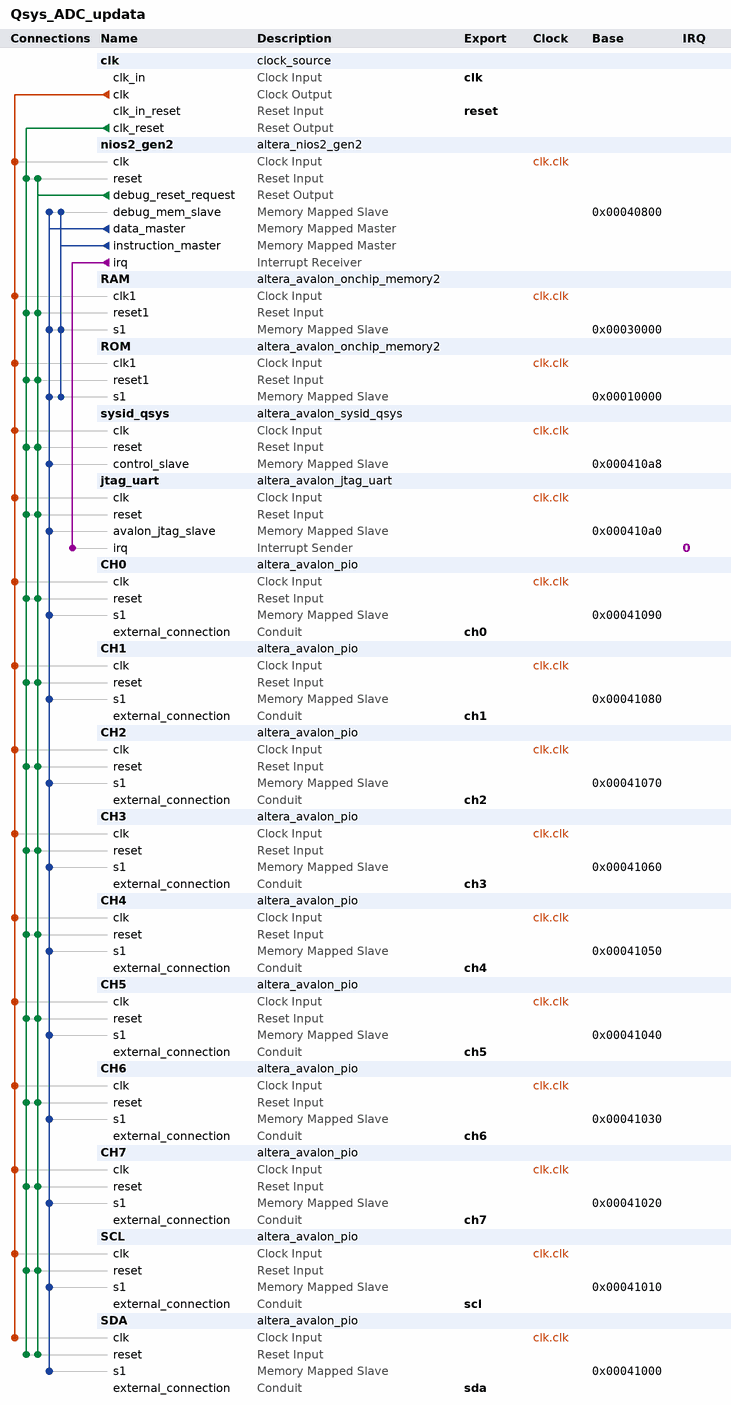
[diagram p0: system contents]
# Platform Designer (Qsys) system Qsys_ADC_updata, Cyclone V 5CSEMA5F31C6
# Parameters at their usual value, and those the tool derives, are not listed.
package require -exact qsys 17.1
create_system Qsys_ADC_updata
set_project_property DEVICE_FAMILY {Cyclone V}
set_project_property DEVICE 5CSEMA5F31C6

add_instance clk clock_source 17.1
set_instance_parameter_value clk clockFrequency 100000000

add_instance nios2_gen2 altera_nios2_gen2 17.1
set_instance_parameter_value nios2_gen2 dcache_size 2048
set_instance_parameter_value nios2_gen2 exceptionSlave RAM.s1
set_instance_parameter_value nios2_gen2 icache_size 4096
set_instance_parameter_value nios2_gen2 impl Fast
set_instance_parameter_value nios2_gen2 resetSlave ROM.s1

add_instance RAM altera_avalon_onchip_memory2 17.1
set_instance_parameter_value RAM dataWidth 32
set_instance_parameter_value RAM dualPort false
set_instance_parameter_value RAM initMemContent true
set_instance_parameter_value RAM initializationFileName E:/DE1-SoC/FPGA_Qsys/Qsys_ADC_update/software/Qsys_ADC_updata/mem_init/Qsys_ADC_updata_RAM.hex
set_instance_parameter_value RAM memorySize 40960
set_instance_parameter_value RAM useNonDefaultInitFile true

add_instance ROM altera_avalon_onchip_memory2 17.1
set_instance_parameter_value ROM dataWidth 32
set_instance_parameter_value ROM dualPort false
set_instance_parameter_value ROM initMemContent true
set_instance_parameter_value ROM initializationFileName E:/DE1-SoC/FPGA_Qsys/Qsys_ADC_update/software/Qsys_ADC_updata/mem_init/Qsys_ADC_updata_ROM.hex
set_instance_parameter_value ROM memorySize 65536
set_instance_parameter_value ROM useNonDefaultInitFile true
set_instance_parameter_value ROM writable false

add_instance sysid_qsys altera_avalon_sysid_qsys 17.1
set_instance_parameter_value sysid_qsys id 0

add_instance jtag_uart altera_avalon_jtag_uart 17.1
set_instance_parameter_value jtag_uart simInteractiveOptions NO_INTERACTIVE_WINDOWS

add_instance CH0 altera_avalon_pio 17.1
set_instance_parameter_value CH0 direction Input
set_instance_parameter_value CH0 width 12

add_instance CH1 altera_avalon_pio 17.1
set_instance_parameter_value CH1 direction Input
set_instance_parameter_value CH1 width 12

add_instance CH2 altera_avalon_pio 17.1
set_instance_parameter_value CH2 direction Input
set_instance_parameter_value CH2 width 12

add_instance CH3 altera_avalon_pio 17.1
set_instance_parameter_value CH3 direction Input
set_instance_parameter_value CH3 width 12

add_instance CH4 altera_avalon_pio 17.1
set_instance_parameter_value CH4 direction Input
set_instance_parameter_value CH4 width 12

add_instance CH5 altera_avalon_pio 17.1
set_instance_parameter_value CH5 direction Input
set_instance_parameter_value CH5 width 12

add_instance CH6 altera_avalon_pio 17.1
set_instance_parameter_value CH6 direction Input
set_instance_parameter_value CH6 width 12

add_instance CH7 altera_avalon_pio 17.1
set_instance_parameter_value CH7 direction Input
set_instance_parameter_value CH7 width 12

add_instance SCL altera_avalon_pio 17.1
set_instance_parameter_value SCL direction Output
set_instance_parameter_value SCL width 1

add_instance SDA altera_avalon_pio 17.1
set_instance_parameter_value SDA direction Bidir
set_instance_parameter_value SDA width 1

# connections
add_connection clk.clk CH0.clk clock
add_connection clk.clk CH1.clk clock
add_connection clk.clk CH2.clk clock
add_connection clk.clk CH3.clk clock
add_connection clk.clk CH4.clk clock
add_connection clk.clk CH5.clk clock
add_connection clk.clk CH6.clk clock
add_connection clk.clk CH7.clk clock
add_connection clk.clk jtag_uart.clk clock
add_connection clk.clk nios2_gen2.clk clock
add_connection clk.clk RAM.clk1 clock
add_connection clk.clk ROM.clk1 clock
add_connection clk.clk SCL.clk clock
add_connection clk.clk SDA.clk clock
add_connection clk.clk sysid_qsys.clk clock
add_connection clk.clk_reset CH0.reset reset
add_connection clk.clk_reset CH1.reset reset
add_connection clk.clk_reset CH2.reset reset
add_connection clk.clk_reset CH3.reset reset
add_connection clk.clk_reset CH4.reset reset
add_connection clk.clk_reset CH5.reset reset
add_connection clk.clk_reset CH6.reset reset
add_connection clk.clk_reset CH7.reset reset
add_connection clk.clk_reset jtag_uart.reset reset
add_connection clk.clk_reset nios2_gen2.reset reset
add_connection clk.clk_reset RAM.reset1 reset
add_connection clk.clk_reset ROM.reset1 reset
add_connection clk.clk_reset SCL.reset reset
add_connection clk.clk_reset SDA.reset reset
add_connection clk.clk_reset sysid_qsys.reset reset
add_connection nios2_gen2.debug_reset_request CH0.reset reset
add_connection nios2_gen2.debug_reset_request CH1.reset reset
add_connection nios2_gen2.debug_reset_request CH2.reset reset
add_connection nios2_gen2.debug_reset_request CH3.reset reset
add_connection nios2_gen2.debug_reset_request CH4.reset reset
add_connection nios2_gen2.debug_reset_request CH5.reset reset
add_connection nios2_gen2.debug_reset_request CH6.reset reset
add_connection nios2_gen2.debug_reset_request CH7.reset reset
add_connection nios2_gen2.debug_reset_request jtag_uart.reset reset
add_connection nios2_gen2.debug_reset_request nios2_gen2.reset reset
add_connection nios2_gen2.debug_reset_request RAM.reset1 reset
add_connection nios2_gen2.debug_reset_request ROM.reset1 reset
add_connection nios2_gen2.debug_reset_request SCL.reset reset
add_connection nios2_gen2.debug_reset_request SDA.reset reset
add_connection nios2_gen2.debug_reset_request sysid_qsys.reset reset
add_connection nios2_gen2.data_master CH0.s1 avalon
set_connection_parameter_value nios2_gen2.data_master/CH0.s1 baseAddress 0x00041090
add_connection nios2_gen2.data_master CH1.s1 avalon
set_connection_parameter_value nios2_gen2.data_master/CH1.s1 baseAddress 0x00041080
add_connection nios2_gen2.data_master CH2.s1 avalon
set_connection_parameter_value nios2_gen2.data_master/CH2.s1 baseAddress 0x00041070
add_connection nios2_gen2.data_master CH3.s1 avalon
set_connection_parameter_value nios2_gen2.data_master/CH3.s1 baseAddress 0x00041060
add_connection nios2_gen2.data_master CH4.s1 avalon
set_connection_parameter_value nios2_gen2.data_master/CH4.s1 baseAddress 0x00041050
add_connection nios2_gen2.data_master CH5.s1 avalon
set_connection_parameter_value nios2_gen2.data_master/CH5.s1 baseAddress 0x00041040
add_connection nios2_gen2.data_master CH6.s1 avalon
set_connection_parameter_value nios2_gen2.data_master/CH6.s1 baseAddress 0x00041030
add_connection nios2_gen2.data_master CH7.s1 avalon
set_connection_parameter_value nios2_gen2.data_master/CH7.s1 baseAddress 0x00041020
add_connection nios2_gen2.data_master jtag_uart.avalon_jtag_slave avalon
set_connection_parameter_value nios2_gen2.data_master/jtag_uart.avalon_jtag_slave baseAddress 0x000410a0
add_connection nios2_gen2.data_master nios2_gen2.debug_mem_slave avalon
set_connection_parameter_value nios2_gen2.data_master/nios2_gen2.debug_mem_slave baseAddress 0x00040800
add_connection nios2_gen2.data_master RAM.s1 avalon
set_connection_parameter_value nios2_gen2.data_master/RAM.s1 baseAddress 0x00030000
add_connection nios2_gen2.data_master ROM.s1 avalon
set_connection_parameter_value nios2_gen2.data_master/ROM.s1 baseAddress 0x00010000
add_connection nios2_gen2.data_master SCL.s1 avalon
set_connection_parameter_value nios2_gen2.data_master/SCL.s1 baseAddress 0x00041010
add_connection nios2_gen2.data_master SDA.s1 avalon
set_connection_parameter_value nios2_gen2.data_master/SDA.s1 baseAddress 0x00041000
add_connection nios2_gen2.data_master sysid_qsys.control_slave avalon
set_connection_parameter_value nios2_gen2.data_master/sysid_qsys.control_slave baseAddress 0x000410a8
add_connection nios2_gen2.instruction_master nios2_gen2.debug_mem_slave avalon
set_connection_parameter_value nios2_gen2.instruction_master/nios2_gen2.debug_mem_slave baseAddress 0x00040800
add_connection nios2_gen2.instruction_master RAM.s1 avalon
set_connection_parameter_value nios2_gen2.instruction_master/RAM.s1 baseAddress 0x00030000
add_connection nios2_gen2.instruction_master ROM.s1 avalon
set_connection_parameter_value nios2_gen2.instruction_master/ROM.s1 baseAddress 0x00010000
add_connection nios2_gen2.irq jtag_uart.irq interrupt
set_connection_parameter_value nios2_gen2.irq/jtag_uart.irq irqNumber 0

# exported interfaces
add_interface ch0 conduit end
set_interface_property ch0 EXPORT_OF CH0.external_connection
add_interface ch1 conduit end
set_interface_property ch1 EXPORT_OF CH1.external_connection
add_interface ch2 conduit end
set_interface_property ch2 EXPORT_OF CH2.external_connection
add_interface ch3 conduit end
set_interface_property ch3 EXPORT_OF CH3.external_connection
add_interface ch4 conduit end
set_interface_property ch4 EXPORT_OF CH4.external_connection
add_interface ch5 conduit end
set_interface_property ch5 EXPORT_OF CH5.external_connection
add_interface ch6 conduit end
set_interface_property ch6 EXPORT_OF CH6.external_connection
add_interface ch7 conduit end
set_interface_property ch7 EXPORT_OF CH7.external_connection
add_interface clk clock sink
set_interface_property clk EXPORT_OF clk.clk_in
add_interface reset reset sink
set_interface_property reset EXPORT_OF clk.clk_in_reset
add_interface scl conduit end
set_interface_property scl EXPORT_OF SCL.external_connection
add_interface sda conduit end
set_interface_property sda EXPORT_OF SDA.external_connection

set_interconnect_requirement {$system} qsys_mm.clockCrossingAdapter HANDSHAKE
set_interconnect_requirement {$system} qsys_mm.enableEccProtection FALSE
set_interconnect_requirement {$system} qsys_mm.insertDefaultSlave FALSE
set_interconnect_requirement {$system} qsys_mm.maxAdditionalLatency 1

save_system Qsys_ADC_updata.qsys
